# Altium schematic sheet INA333_ADS1118_yusnows.SchDoc
size A4
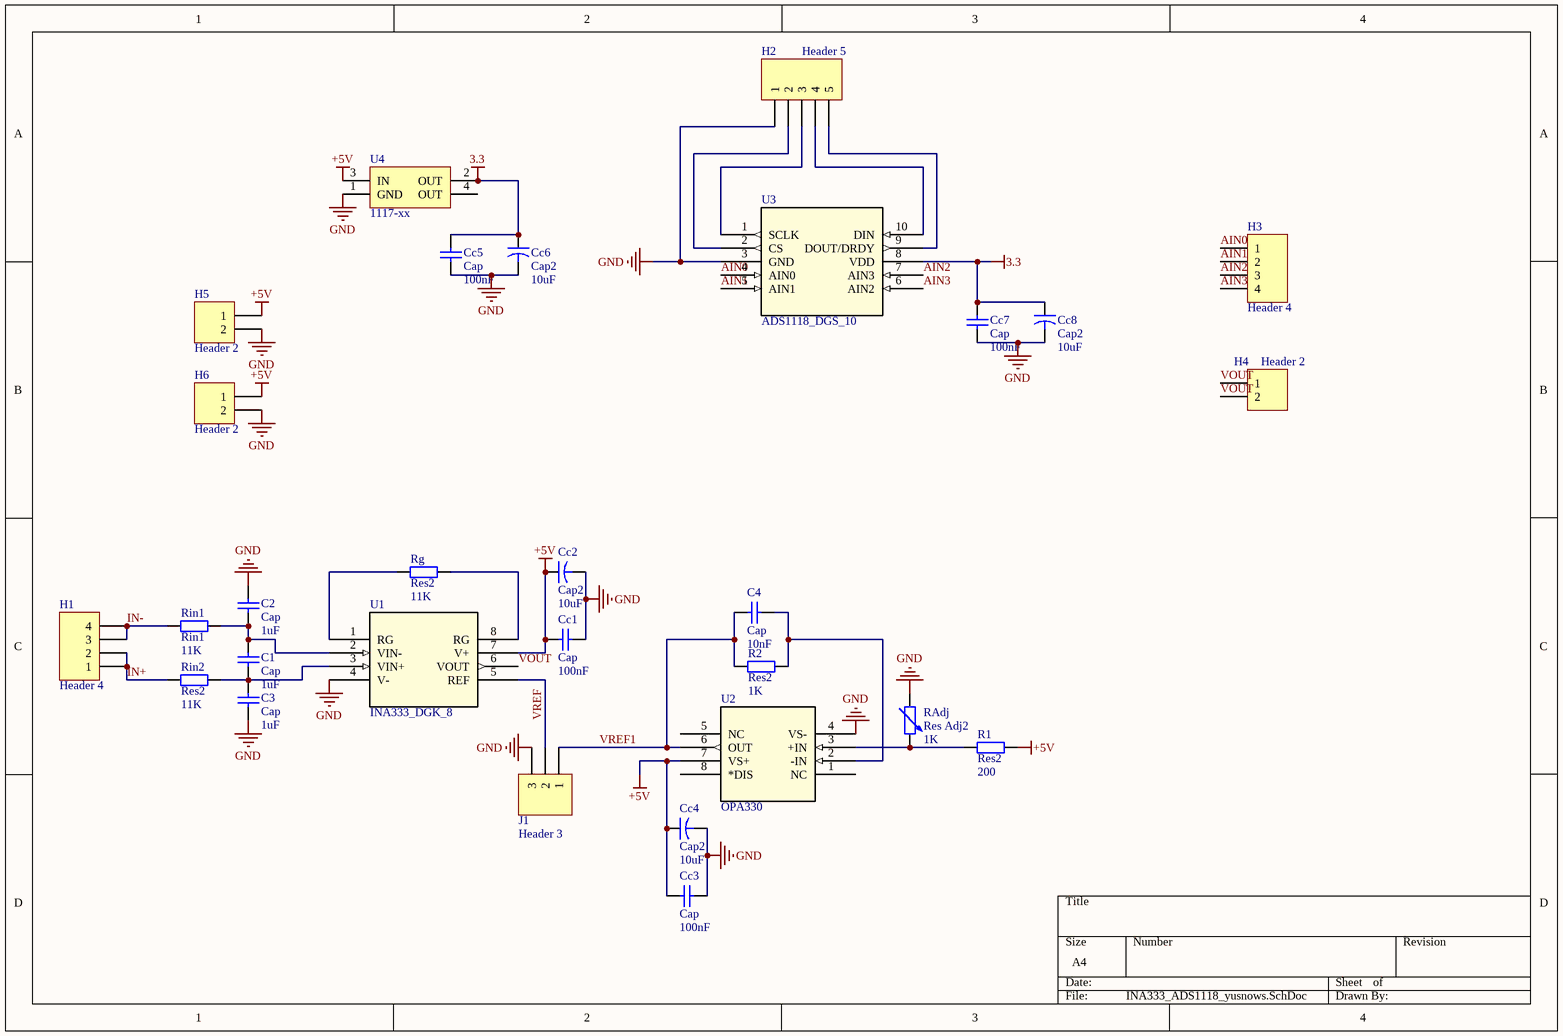
[diagram p0: INA333_ADS1118_yusnows.SchDoc]

## Parts
C1  Cap  value 1uF  [0805C]
C2  Cap  value 1uF  [0805C]
C3  Cap  value 1uF  [0805C]
C4  Cap  value 10nF  [0805C]
Cc1  Cap  value 100nF  [0805C]
Cc2  Cap2  value 10uF  [CAP_SMD_3216]
Cc3  Cap  value 100nF  [0805C]
Cc4  Cap2  value 10uF  [CAP_SMD_3216]
Cc5  Cap  value 100nF  [0805C]
Cc6  Cap2  value 10uF  [CAP_SMD_3216]
Cc7  Cap  value 100nF  [0805C]
Cc8  Cap2  value 10uF  [CAP_SMD_3216]
H1  Header 4  [HDR1X4]
H2  Header 5  [HDR1X5]
H3  Header 4  [HDR1X4]
H4  Header 2  [HDR1X2]
H5  Header 2  [HDR1X2]
H6  Header 2  [HDR1X2]
J1  Header 3  [HDR1X3]
R1  Res2  value 200  [0805R]
R2  Res2  value 1K  [0805R]
RAdj  Res Adj2  value 1K  [PRS_POT]
Rg  Res2  value 11K  [0805R]
Rin1  Rin1  value 11K  [0805R]
Rin2  Res2  value 11K  [0805R]
U1  INA333_DGK_8  [DGK8]
U2  OPA330  [D8]
U3  ADS1118_DGS_10  [DGS10]
U4  1117-xx  [SOT-223_]

## Nets
3.3: Cc5.2 Cc6.1 Cc7.2 Cc8.1 U3.8(VDD) U4.2(OUT)
+5V: Cc1.2 Cc2.1 Cc3.2 Cc4.1 H5.1 H6.1 R1.2 U1.7(V+) U2.7(VS+) U4.3(IN)
GND: C2.2 C3.1 Cc1.1 Cc2.2 Cc3.1 Cc4.2 Cc5.1 Cc6.2 Cc7.1 Cc8.2 H2.1 H5.2 H6.2 J1.3 RAdj.1 U1.4(V-) U2.4(VS-) U3.3(GND) U4.1(GND)
AIN0: H3.1 U3.4(AIN0)
AIN1: H3.2 U3.5(AIN1)
AIN2: H3.3 U3.7(AIN3)
AIN3: H3.4 U3.6(AIN2)
IN+: H1.1 H1.2 Rin2.1
IN-: H1.3 H1.4 Rin1.1
VOUT: H4.1 H4.2 U1.6(VOUT)
VREF: J1.2 U1.5(REF)
VREF1: C4.2 J1.1 R2.1 U2.6(OUT)
NetC1_1: C1.1 C3.2 Rin2.2 U1.3(VIN+)
NetC1_2: C1.2 C2.1 Rin1.2 U1.2(VIN-)
NetC4_1: C4.1 R2.2 U2.2(-IN)
NetH2_2: H2.2 U3.2(CS)
NetH2_3: H2.3 U3.1(SCLK)
NetH2_4: H2.4 U3.10(DIN)
NetH2_5: H2.5 U3.9(DOUT/DRDY)
NetR1_1: R1.1 RAdj.2 U2.3(+IN)
NetRg_1: Rg.1 U1.1(RG)
NetRg_2: Rg.2 U1.8(RG)

Not connected (* = marked no-connect by the designer): U2 1(NC) 5(NC) 8(*DIS); U4 4(OUT)

## Library data of the parts
C1-C4 Cc1 Cc3 Cc5 Cc7 = Cap: Capacitor; Published: 8-Jun-2000; LatestRevisionDate: 17-Jul-2002; LatestRevisionNote: Re-released for DXP Platform.; PackageReference: RAD-0.3; Publisher: Altium Limited; PackageDescription: Radial Cap, Thru-Hole; 2 Leads; 0.3 in Pin Spacing
Cc2 Cc4 Cc6 Cc8 = Cap2: Capacitor; Published: 23-Sep-2002; PackageReference: CAPR5-4X5; Publisher: Altium Limited; PackageDescription: Capacitor; 2 Leads
H1 H3 = Header 4: Header, 4-Pin; LatestRevisionDate: 17-Jul-2002; LatestRevisionNote: Re-released for DXP Platform.; Publisher: Altium Limited
H2 = Header 5: Header, 5-Pin; LatestRevisionDate: 17-Jul-2002; LatestRevisionNote: Re-released for DXP Platform.; Publisher: Altium Limited
H4-H6 = Header 2: Header, 2-Pin; LatestRevisionDate: 17-Jul-2002; LatestRevisionNote: Re-released for DXP Platform.; Publisher: Altium Limited
J1 = Header 3: Header, 3-Pin; LatestRevisionDate: 17-Jul-2002; LatestRevisionNote: Re-released for DXP Platform.; Publisher: Altium Limited
R1 R2 Rg Rin1 Rin2 = Res2: Resistor; Published: 8-Jun-2000; LatestRevisionDate: 17-Jul-2002; LatestRevisionNote: Re-released for DXP Platform.; PackageReference: AXIAL-0.4; Publisher: Altium Limited; PackageDescription: Axial Device, Thru-Hole; 2 Leads; 0.4 in Pin Spacing
RAdj = Res Adj2: Variable Resistor; Set Position: 0.5; Published: 8-Jun-2000; LatestRevisionDate: 17-Jul-2002; LatestRevisionNote: Re-released for DXP Platform.; PackageReference: AXIAL-0.6; Publisher: Altium Limited; PackageDescription: Axial Device, Thru-Hole; 2 Leads; 0.6 in Pin Spacing
U1 = INA333_DGK_8: Imported; Manufacturer: Texas Instruments; GENERIC_PART_NUMBER: INA333; INDUSTRY_STD_PKG_TYPE: MSOP; FAMILY_NAME: SINGLE SUPPLY; PIN_COUNT: 8; PACKAGE_DESIGNATOR: DGK; Datasheet_URL: http://www.ti.com/lit/gpn/INA333; Vendor: Texas Instruments; Manufacturer_Part_Number: ina333_dgk_8; Value: Value; Type: Type; RefDes: RefDes
U2 = OPA691_D_8: Imported; Manufacturer: Texas Instruments; GENERIC_PART_NUMBER: OPA691; INDUSTRY_STD_PKG_TYPE: SOIC; FAMILY_NAME: CURRENT FEEDBACK; PIN_COUNT: 8; PACKAGE_DESIGNATOR: D; Datasheet_URL: http://www.ti.com/lit/gpn/OPA691; Vendor: Texas Instruments; Manufacturer_Part_Number: opa691_d_8; Value: Value; Type: Type; RefDes: RefDes
U3 = ADS1118_DGS_10: Imported; Manufacturer: Texas Instruments; INDUSTRY_STD_PKG_TYPE: MSOP; FAMILY_NAME: PRECISION ADC (<=10MSPS); PIN_COUNT: 10; PACKAGE_DESIGNATOR: DGS; Datasheet_URL: http://www.ti.com/lit/gpn/ADS1118; GENERIC_PART_NUMBER: ADS1118; Value: Value; Type: Type; RefDes: RefDes
U4 = 1117-xx: 稳压芯片